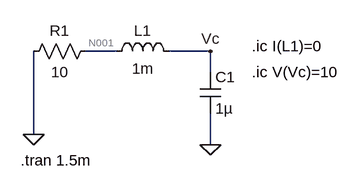
[diagram p0: schematic power_RLC_sourceFree_with_cap_initial_condition.asc]
power_RLC_sourceFree_with_cap_initial_condition.asc, the LTspice schematic file:
Version 4
SHEET 1 880 680
WIRE 144 64 96 64
WIRE 288 64 224 64
WIRE 288 96 288 64
WIRE 16 192 16 64
WIRE 288 208 288 160
FLAG 288 208 0
FLAG 16 192 0
FLAG 288 64 Vc
SYMBOL res 112 48 R90
WINDOW 0 0 56 VBottom 2
WINDOW 3 32 56 VTop 2
SYMATTR InstName R1
SYMATTR Value 10
SYMBOL ind 128 80 R270
WINDOW 0 32 56 VTop 2
WINDOW 3 5 56 VBottom 2
SYMATTR InstName L1
SYMATTR Value 1m
SYMBOL cap 272 96 R0
SYMATTR InstName C1
SYMATTR Value 1µ
TEXT 352 56 Left 2 !.ic I(L1)=0
TEXT 352 96 Left 2 !.ic V(Vc)=10
TEXT -4 232 Left 2 !.tran 1.5m

The netlist it stands for:
* power_RLC_sourceFree_with_cap_initial_condition.asc
R1 N001 0 10
L1 N001 Vc 1m
C1 Vc 0 1µ
.ic I(L1)=0
.ic V(Vc)=10
.tran 1.5m
.backanno
.end

* Results of the author's LTspice run, read from the files saved beside the schematic
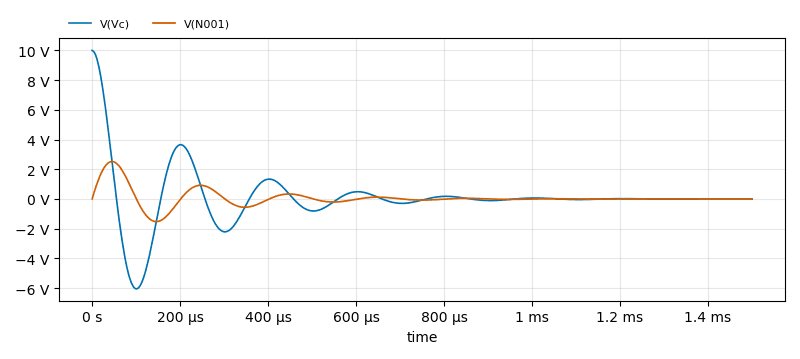
[diagram p1: Transient Analysis of power_RLC_sourceFree_with_cap_initial_condition.asc, plotted from the saved traces]
* Transient Analysis, 1 run:
*   V(Vc): min -6.043 V, max 10 V, average 66.71 mV, rms 1.915 V, last -5.053 mV
*   V(N001): min -1.522 V, max 2.52 V, average 66.62 mV, rms 577.1 mV, last 515 µV